# EAGLE schematic deska (EAGLE 7.3.0)
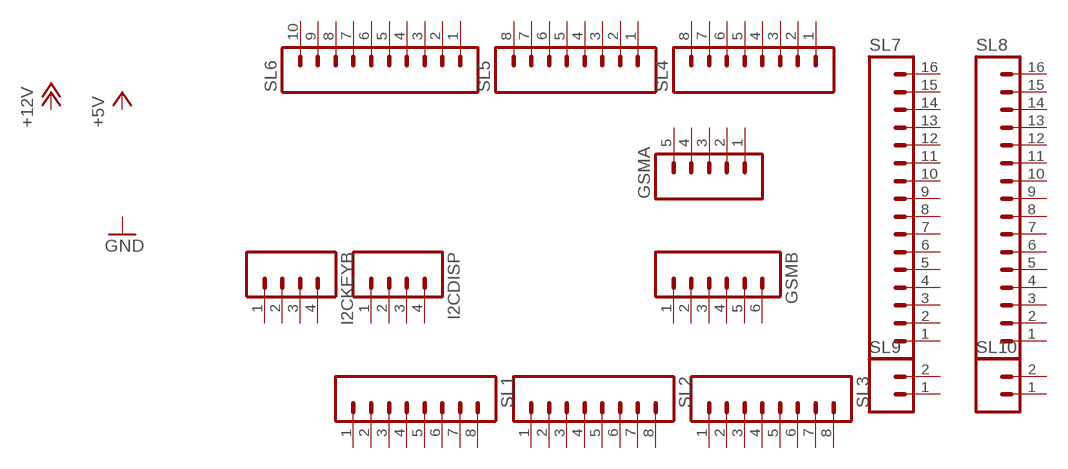
[diagram p0: schematic, sheet 1]

## Parts
GSMA  M05  [05P]
GSMB  M06  [06P]
I2CDISP  M04  [04P]
I2CKEYB  M04  [04P]
SL1  M08  [08P]
SL2  M08  [08P]
SL3  M08  [08P]
SL4  M08  [08P]
SL5  M08  [08P]
SL6  M10  [10P]
SL7  M16  [16P]
SL8  M16  [16P]
SL9  M02  [02P]
SL10  M02  [02P]
Unconnected: GSMA.1 GSMA.2 GSMA.3 GSMA.4 GSMA.5 GSMB.1 GSMB.2 GSMB.3 GSMB.4 GSMB.5 GSMB.6 I2CDISP.1 I2CDISP.2 I2CDISP.3 I2CDISP.4 I2CKEYB.1 I2CKEYB.2 I2CKEYB.3 I2CKEYB.4 SL1.1 SL1.2 SL1.3 SL1.4 SL1.5 SL1.6 SL1.7 SL1.8 SL2.1 SL2.2 SL2.3 SL2.4 SL2.5 SL2.6 SL2.7 SL2.8 SL3.1 SL3.2 SL3.3 SL3.4 SL3.5 SL3.6 SL3.7 SL3.8 SL4.1 SL4.2 SL4.3 SL4.4 SL4.5 SL4.6 SL4.7 SL4.8 SL5.1 SL5.2 SL5.3 SL5.4 SL5.5 SL5.6 SL5.7 SL5.8 SL6.1 SL6.2 SL6.3 SL6.4 SL6.5 SL6.6 SL6.7 SL6.8 SL6.9 SL6.10 SL7.1 SL7.2 SL7.3 SL7.4 SL7.5 SL7.6 SL7.7 SL7.8 SL7.9 SL7.10 SL7.11 SL7.12 SL7.13 SL7.14 SL7.15 SL7.16 SL8.1 SL8.2 SL8.3 SL8.4 SL8.5 SL8.6 SL8.7 SL8.8 SL8.9 SL8.10 SL8.11 SL8.12 SL8.13 SL8.14 SL8.15 SL8.16 SL9.1 SL9.2 SL10.1 SL10.2

## Library data of the parts
GSMA = con-amp-quick:M05: AMP QUICK CONNECTOR; OC_FARNELL: unknown; OC_NEWARK: unknown
GSMB = con-amp-quick:M06: AMP QUICK CONNECTOR; OC_FARNELL: unknown; OC_NEWARK: unknown
I2CDISP I2CKEYB = con-amp-quick:M04: AMP QUICK CONNECTOR; OC_FARNELL: unknown; OC_NEWARK: unknown
SL1-SL5 = con-amp-quick:M08: AMP QUICK CONNECTOR; OC_FARNELL: unknown; OC_NEWARK: unknown
SL6 = con-amp-quick:M10: AMP QUICK CONNECTOR; OC_FARNELL: unknown; OC_NEWARK: unknown
SL7 SL8 = con-amp-quick:M16: AMP QUICK CONNECTOR; OC_FARNELL: unknown; OC_NEWARK: unknown
SL9 SL10 = con-amp-quick:M02: AMP QUICK CONNECTOR; OC_FARNELL: unknown; OC_NEWARK: unknown